# EAGLE design sunhub8_v1.0 (EAGLE 6.2)
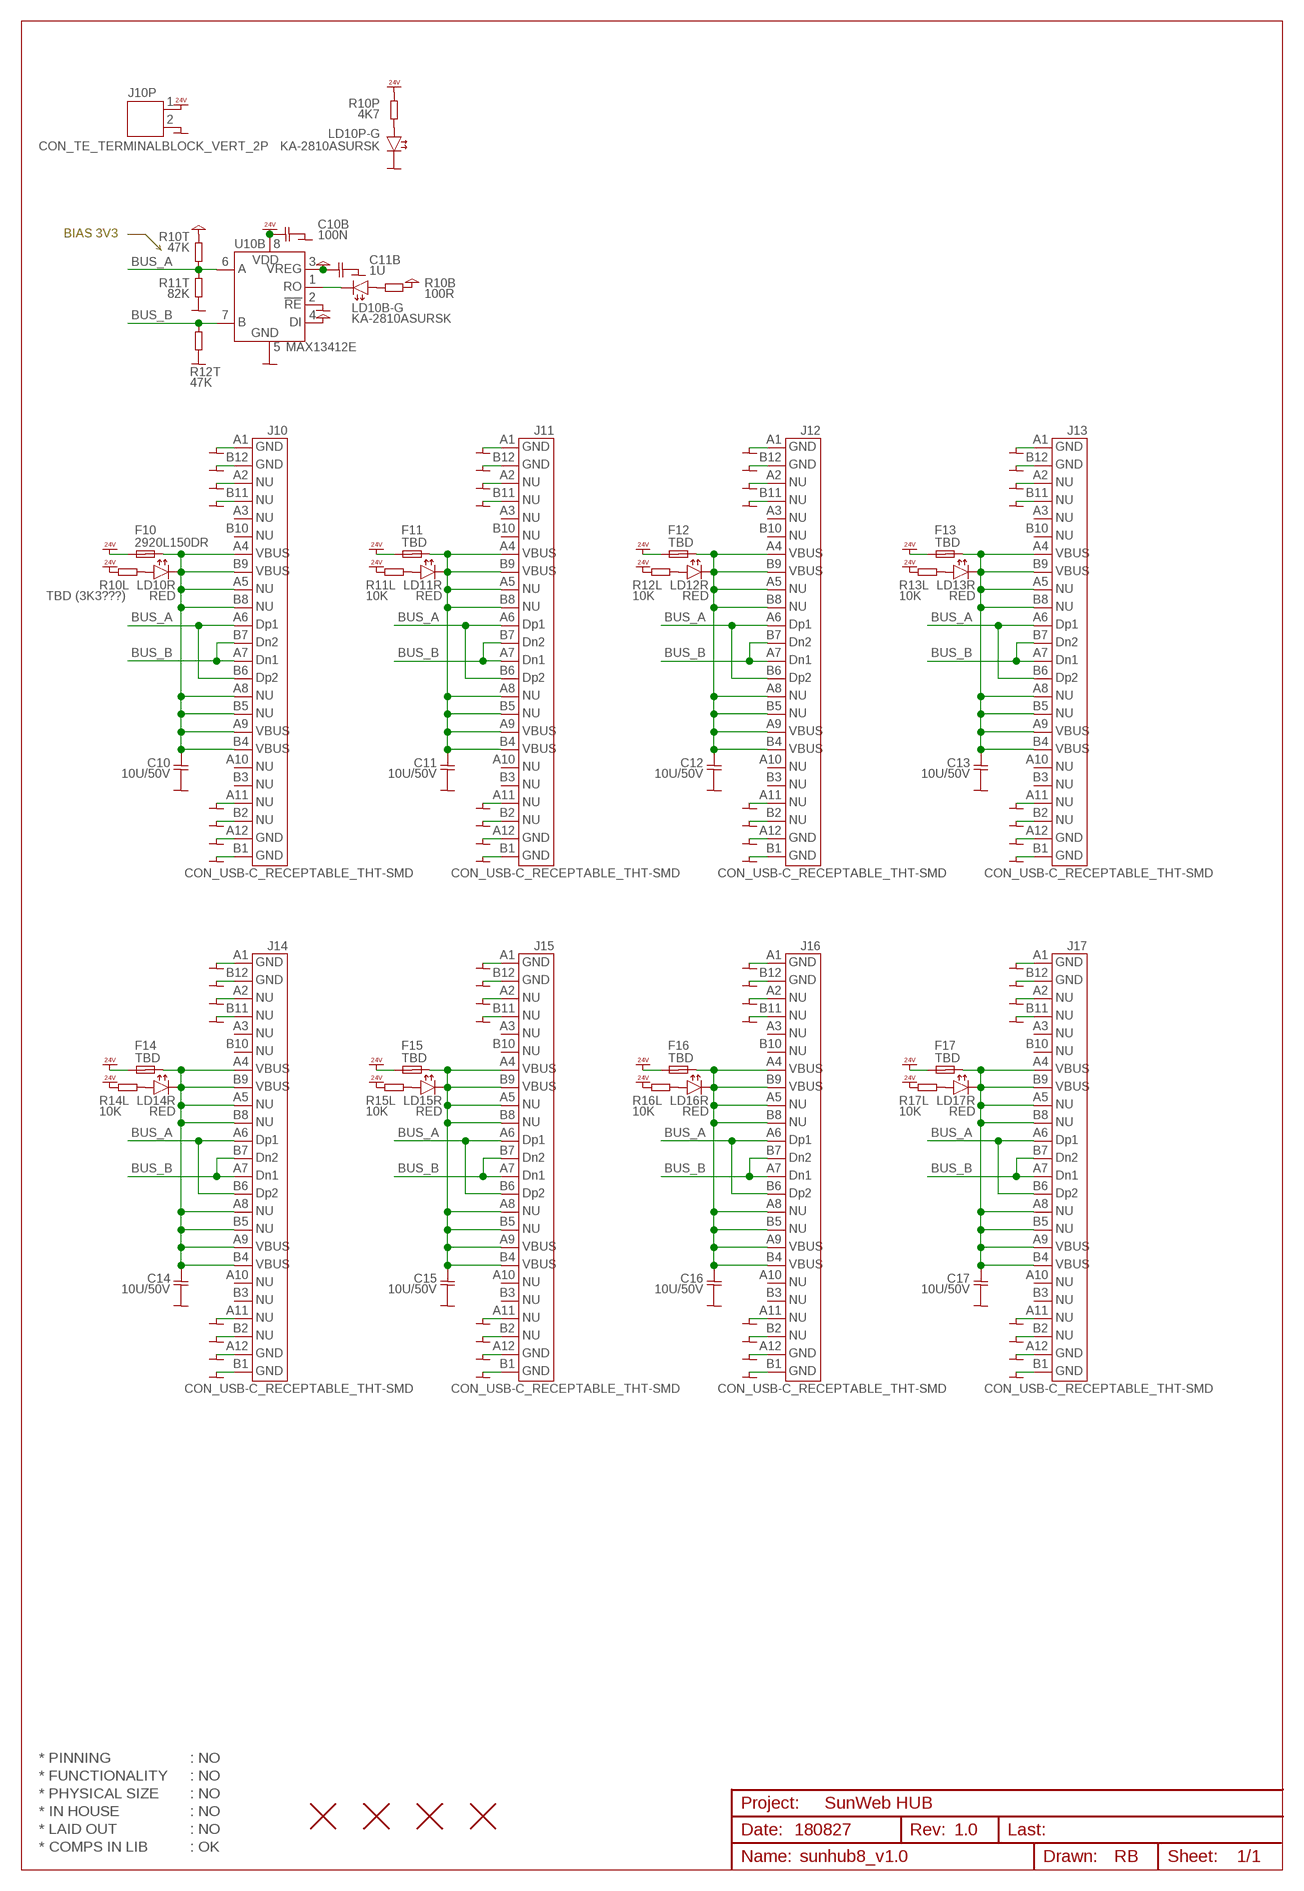
[diagram p0: schematic, sheet 1]

## Parts
C10  10U/50V  CAP1206  [CAP1206]
C10B  100N  CAP0603  [CAP0603]
C11  10U/50V  CAP1206  [CAP1206]
C11B  1U  CAP0603  [CAP0603]
C12  10U/50V  CAP1206  [CAP1206]
C13  10U/50V  CAP1206  [CAP1206]
C14  10U/50V  CAP1206  [CAP1206]
C15  10U/50V  CAP1206  [CAP1206]
C16  10U/50V  CAP1206  [CAP1206]
C17  10U/50V  CAP1206  [CAP1206]
F10  2920L150DR  POLYFUSE2920  [POLYFUSE2920]
F11  TBD  POLYFUSE2920  [POLYFUSE2920]
F12  TBD  POLYFUSE2920  [POLYFUSE2920]
F13  TBD  POLYFUSE2920  [POLYFUSE2920]
F14  TBD  POLYFUSE2920  [POLYFUSE2920]
F15  TBD  POLYFUSE2920  [POLYFUSE2920]
F16  TBD  POLYFUSE2920  [POLYFUSE2920]
F17  TBD  POLYFUSE2920  [POLYFUSE2920]
H1  HOLE_NPTH_3.2MM  [HOLE_NPTH_3.2MM]
H2  HOLE_NPTH_3.2MM  [HOLE_NPTH_3.2MM]
H3  HOLE_NPTH_3.2MM  [HOLE_NPTH_3.2MM]
H4  HOLE_NPTH_3.2MM  [HOLE_NPTH_3.2MM]
J10  CON_USB-C_RECEPTABLE_THT-SMD  [CON_USB-C_RECEPTABLE_THT-SMD]
J10P  CON_TE_TERMINALBLOCK_VERT_2P  [CON_TE_TERMINALBLOCK_VERT_2P]
J11  CON_USB-C_RECEPTABLE_THT-SMD  [CON_USB-C_RECEPTABLE_THT-SMD]
J12  CON_USB-C_RECEPTABLE_THT-SMD  [CON_USB-C_RECEPTABLE_THT-SMD]
J13  CON_USB-C_RECEPTABLE_THT-SMD  [CON_USB-C_RECEPTABLE_THT-SMD]
J14  CON_USB-C_RECEPTABLE_THT-SMD  [CON_USB-C_RECEPTABLE_THT-SMD]
J15  CON_USB-C_RECEPTABLE_THT-SMD  [CON_USB-C_RECEPTABLE_THT-SMD]
J16  CON_USB-C_RECEPTABLE_THT-SMD  [CON_USB-C_RECEPTABLE_THT-SMD]
J17  CON_USB-C_RECEPTABLE_THT-SMD  [CON_USB-C_RECEPTABLE_THT-SMD]
LD10B-G  KA-2810ASURSK  LED_SMD_ANGLE  [LED_SMD_ANGLE]
LD10P-G  KA-2810ASURSK  LED_SMD_ANGLE  [LED_SMD_ANGLE]
LD10R  RED  LED_SMD_ANGLE  [LED_SMD_ANGLE]
LD11R  RED  LED_SMD_ANGLE  [LED_SMD_ANGLE]
LD12R  RED  LED_SMD_ANGLE  [LED_SMD_ANGLE]
LD13R  RED  LED_SMD_ANGLE  [LED_SMD_ANGLE]
LD14R  RED  LED_SMD_ANGLE  [LED_SMD_ANGLE]
LD15R  RED  LED_SMD_ANGLE  [LED_SMD_ANGLE]
LD16R  RED  LED_SMD_ANGLE  [LED_SMD_ANGLE]
LD17R  RED  LED_SMD_ANGLE  [LED_SMD_ANGLE]
R10B  100R  RES0603  [RES0603]
R10L  TBD (3K3???)  RES0603  [RES0603]
R10P  4K7  RES0603  [RES0603]
R10T  47K  RES0603  [RES0603]
R11L  10K  RES0603  [RES0603]
R11T  82K  RES0603  [RES0603]
R12L  10K  RES0603  [RES0603]
R12T  47K  RES0603  [RES0603]
R13L  10K  RES0603  [RES0603]
R14L  10K  RES0603  [RES0603]
R15L  10K  RES0603  [RES0603]
R16L  10K  RES0603  [RES0603]
R17L  10K  RES0603  [RES0603]
U10B  MAX13412E  [SO8]

## Nets
BUS_A: J10.A6(A6.DP1) J10.B6(B6.DP2) J11.A6(A6.DP1) J11.B6(B6.DP2) J12.A6(A6.DP1) J12.B6(B6.DP2) J13.A6(A6.DP1) J13.B6(B6.DP2) J14.A6(A6.DP1) J14.B6(B6.DP2) J15.A6(A6.DP1) J15.B6(B6.DP2) J16.A6(A6.DP1) J16.B6(B6.DP2) J17.A6(A6.DP1) J17.B6(B6.DP2) R10T.2 R11T.1 U10B.6(6.A)
BUS_B: J10.A7(A7.DN1) J10.B7(B7.DN2) J11.A7(A7.DN1) J11.B7(B7.DN2) J12.A7(A7.DN1) J12.B7(B7.DN2) J13.A7(A7.DN1) J13.B7(B7.DN2) J14.A7(A7.DN1) J14.B7(B7.DN2) J15.A7(A7.DN1) J15.B7(B7.DN2) J16.A7(A7.DN1) J16.B7(B7.DN2) J17.A7(A7.DN1) J17.B7(B7.DN2) R12T.1 U10B.7(7.B)
GND: C10.2 C10B.2 C11.2 C11B.2 C12.2 C13.2 C14.2 C15.2 C16.2 C17.2 J10.A1(A1.GND) J10.A2(A2.NU) J10.A11(A11.NU) J10.A12(A12.GND) J10.B1(B1.GND) J10.B2(B2.NU) J10.B11(B11.NU) J10.B12(B12.GND) J10P.2 J11.A1(A1.GND) J11.A2(A2.NU) J11.A11(A11.NU) J11.A12(A12.GND) J11.B1(B1.GND) J11.B2(B2.NU) J11.B11(B11.NU) J11.B12(B12.GND) J12.A1(A1.GND) J12.A2(A2.NU) J12.A11(A11.NU) J12.A12(A12.GND) J12.B1(B1.GND) J12.B2(B2.NU) J12.B11(B11.NU) J12.B12(B12.GND) J13.A1(A1.GND) J13.A2(A2.NU) J13.A11(A11.NU) J13.A12(A12.GND) J13.B1(B1.GND) J13.B2(B2.NU) J13.B11(B11.NU) J13.B12(B12.GND) J14.A1(A1.GND) J14.A2(A2.NU) J14.A11(A11.NU) J14.A12(A12.GND) J14.B1(B1.GND) J14.B2(B2.NU) J14.B11(B11.NU) J14.B12(B12.GND) J15.A1(A1.GND) J15.A2(A2.NU) J15.A11(A11.NU) J15.A12(A12.GND) J15.B1(B1.GND) J15.B2(B2.NU) J15.B11(B11.NU) J15.B12(B12.GND) J16.A1(A1.GND) J16.A2(A2.NU) J16.A11(A11.NU) J16.A12(A12.GND) J16.B1(B1.GND) J16.B2(B2.NU) J16.B11(B11.NU) J16.B12(B12.GND) J17.A1(A1.GND) J17.A2(A2.NU) J17.A11(A11.NU) J17.A12(A12.GND) J17.B1(B1.GND) J17.B2(B2.NU) J17.B11(B11.NU) J17.B12(B12.GND) LD10P-G.C R11T.2 R12T.2 U10B.2(2.!RE) U10B.5(5.GND)
N$1: C10.1 F10.2 J10.A4(A4.VBUS) J10.A5(A5.NU) J10.A8(A8.NU) J10.A9(A9.VBUS) J10.B4(B4.VBUS) J10.B5(B5.NU) J10.B8(B8.NU) J10.B9(B9.VBUS) LD10R.C
N$2: C11.1 F11.2 J11.A4(A4.VBUS) J11.A5(A5.NU) J11.A8(A8.NU) J11.A9(A9.VBUS) J11.B4(B4.VBUS) J11.B5(B5.NU) J11.B8(B8.NU) J11.B9(B9.VBUS) LD11R.C
N$3: LD11R.A R11L.2
N$4: C12.1 F12.2 J12.A4(A4.VBUS) J12.A5(A5.NU) J12.A8(A8.NU) J12.A9(A9.VBUS) J12.B4(B4.VBUS) J12.B5(B5.NU) J12.B8(B8.NU) J12.B9(B9.VBUS) LD12R.C
N$5: C13.1 F13.2 J13.A4(A4.VBUS) J13.A5(A5.NU) J13.A8(A8.NU) J13.A9(A9.VBUS) J13.B4(B4.VBUS) J13.B5(B5.NU) J13.B8(B8.NU) J13.B9(B9.VBUS) LD13R.C
N$6: C14.1 F14.2 J14.A4(A4.VBUS) J14.A5(A5.NU) J14.A8(A8.NU) J14.A9(A9.VBUS) J14.B4(B4.VBUS) J14.B5(B5.NU) J14.B8(B8.NU) J14.B9(B9.VBUS) LD14R.C
N$7: C15.1 F15.2 J15.A4(A4.VBUS) J15.A5(A5.NU) J15.A8(A8.NU) J15.A9(A9.VBUS) J15.B4(B4.VBUS) J15.B5(B5.NU) J15.B8(B8.NU) J15.B9(B9.VBUS) LD15R.C
N$8: C16.1 F16.2 J16.A4(A4.VBUS) J16.A5(A5.NU) J16.A8(A8.NU) J16.A9(A9.VBUS) J16.B4(B4.VBUS) J16.B5(B5.NU) J16.B8(B8.NU) J16.B9(B9.VBUS) LD16R.C
N$9: C17.1 F17.2 J17.A4(A4.VBUS) J17.A5(A5.NU) J17.A8(A8.NU) J17.A9(A9.VBUS) J17.B4(B4.VBUS) J17.B5(B5.NU) J17.B8(B8.NU) J17.B9(B9.VBUS) LD17R.C
N$10: LD10R.A R10L.2
N$11: LD12R.A R12L.2
N$12: LD13R.A R13L.2
N$13: LD14R.A R14L.2
N$14: LD15R.A R15L.2
N$15: LD16R.A R16L.2
N$16: LD17R.A R17L.2
N$17: LD10B-G.A R10B.1
N$18: LD10B-G.C U10B.1(1.RO)
N$83: LD10P-G.A R10P.2
VCC: C11B.1 R10B.2 R10T.1 U10B.3(3.DE) U10B.4(4.DI)
VDD_24V: C10B.1 F10.1 F11.1 F12.1 F13.1 F14.1 F15.1 F16.1 F17.1 J10P.1 R10L.1 R10P.1 R11L.1 R12L.1 R13L.1 R14L.1 R15L.1 R16L.1 R17L.1 U10B.8(8.VDD) ; supply symbol labelled VCC_24V
Unconnected: J10.A3(A3.NU) J10.A10(A10.NU) J10.B3(B3.NU) J10.B10(B10.NU) J11.A3(A3.NU) J11.A10(A10.NU) J11.B3(B3.NU) J11.B10(B10.NU) J12.A3(A3.NU) J12.A10(A10.NU) J12.B3(B3.NU) J12.B10(B10.NU) J13.A3(A3.NU) J13.A10(A10.NU) J13.B3(B3.NU) J13.B10(B10.NU) J14.A3(A3.NU) J14.A10(A10.NU) J14.B3(B3.NU) J14.B10(B10.NU) J15.A3(A3.NU) J15.A10(A10.NU) J15.B3(B3.NU) J15.B10(B10.NU) J16.A3(A3.NU) J16.A10(A10.NU) J16.B3(B3.NU) J16.B10(B10.NU) J17.A3(A3.NU) J17.A10(A10.NU) J17.B3(B3.NU) J17.B10(B10.NU)

## Notes on the sheet
- BIAS 3V3
- * PINNING | : NO
- * FUNCTIONALITY | : NO
- * PHYSICAL SIZE | : NO
- SunWeb HUB
- * IN HOUSE | : NO
- * LAID OUT | : NO | 180827 | 1.0
- * COMPS IN LIB | : OK

## Library data of the parts
C10-C17 = 00-own_parts:CAP1206: Capacitor, ceramic, 1206
C10B C11B = 00-own_parts:CAP0603: Capacitor, ceramic, 0603
F10-F17 = 00-own_parts:POLYFUSE2920
H1-H4 = 00-own_parts:HOLE_NPTH_3.2MM: Hole, NPTH, 3.2mm
J10-J17 = 00-own_parts:CON_USB-C_RECEPTABLE_THT-SMD: Connector, DB25, male, straight, wirewarp, press nuts, DK#: 2625FA-ND
J10P = 00-own_parts:CON_TE_TERMINALBLOCK_VERT_2P: Connector,TE Conn., terminal block, vertical, 3.5mm, 2p, RS#123-2041
LD10B-G LD10P-G = 00-led_angle:LED_SMD_ANGLE: LED, SMD, right angle, F#214-6470
LD10R LD11R LD12R LD13R LD14R LD15R LD16R LD17R = 00-own_parts:LED_SMD_ANGLE: LED, SMD, right angle, F#214-6470
R10B R10L R10P R10T R11L R11T R12L R12T R13L R14L R15L R16L R17L = 00-own_parts:RES
U10B = 00-own_parts:MAX13412E: Transceiver, RS485, 6..28V, internal 5V LDO, 500kbps, SO8 exposed pad, RS#786-0087

## Board
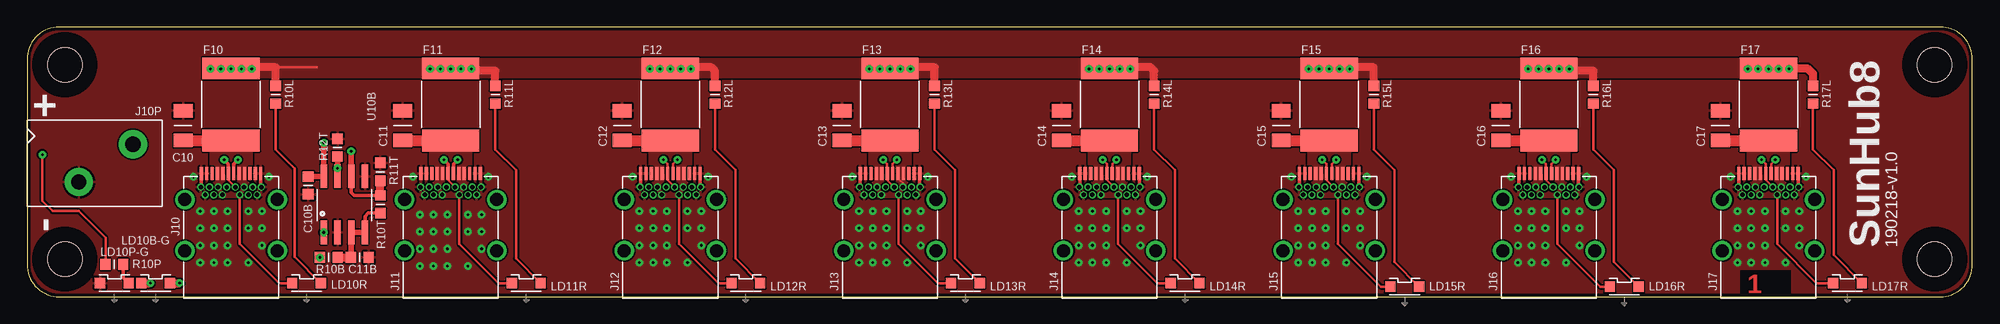
[diagram p1: board, top side]
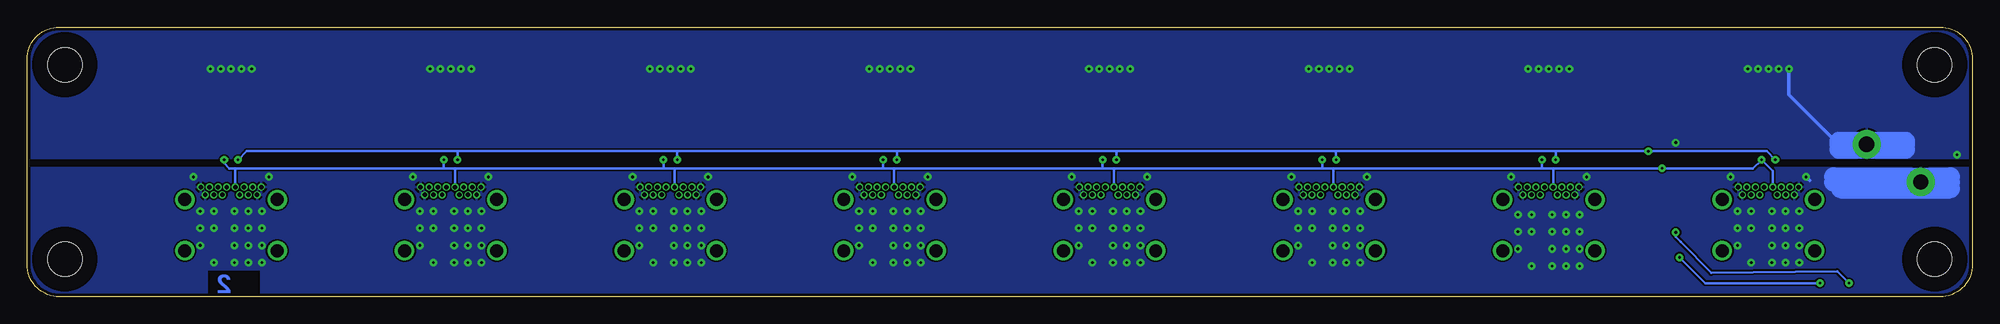
[diagram p2: board, bottom side, seen from below]

Size 180 x 25 mm. Coordinates in mm from the lower left corner, seen from the top.
Outline: 3,0 177,0 arc90 180,3 180,22 arc90 177,25 3,25 arc90 0,22 0,3 arc90 3,0
Copper layers (1*16): Top 0.018mm / dielectric 1.55mm / Bottom 0.018mm
Design rules: minimum track width 0.15mm, minimum drill 0.25mm, track to track 0.15mm, track to pad 0.15mm, pad to pad 0.15mm, via to via 0.15mm, smd to smd 0mil, copper to edge 0.3mm, drill to drill 0.3mm, minimum pad ring 0.125mm, minimum via ring 0.2mm, stop-mask expansion 0.1mm, vias tented up to drill 0.4mm, thermal gap 0.2mm

### Footprints (pad centres in the part's own frame; a part is rotated, then mirrored left to right if it is on the bottom)
CAP1206 = smd 1.25 x 1.75: 1 -1.375,0; 2 1.375,0
CAP0603 = smd 0.95 x 1: 1 -0.821,0.002; 2 0.822,0
POLYFUSE2920 = smd 2 x 5.3: 1 -3.4,0; 2 3.3,0
HOLE_NPTH_3.2MM = hole 3.2: 0,0
CON_USB-C_RECEPTABLE_THT-SMD = smd 0.3 x 1.2: A1 -2.75,1.25; A2 -2.25,1.25; A3 -1.75,1.25; A4 -1.25,1.25; A5 -0.75,1.25; A6 -0.25,1.25; A7 0.25,1.25; A8 0.75,1.25; A9 1.25,1.25; A10 1.75,1.25; A11 2.25,1.25; A12 2.75,1.25 | drill 0.4 pad 0.65: B1 2.8,0; B2 2.4,-0.7; B3 1.6,-0.7; B4 1.2,0; B5 0.8,-0.7; B6 0.4,0; B7 -0.4,0; B8 -0.8,-0.7; B9 -1.2,0; B10 -1.6,-0.7; B11 -2.4,-0.7; B12 -2.8,0; BG1 2,0; BG2 -2,0 | drill 1.2 pad 1.8: C1 -4.27,-5.88; C2 4.27,-5.88; C3 -4.27,-1.15; C4 4.27,-1.15
CON_TE_TERMINALBLOCK_VERT_2P = drill 1.4 pad 2.6: 1 -1.75,3.3; 2 1.75,-1.7
LED_SMD_ANGLE = smd 0.95 x 1: A -1.327,0; C 1.327,0
RES0603 = smd 0.95 x 1: 1 -0.821,0.002; 2 0.822,0
SO8 = smd 0.6 x 2.2: 1 -1.905,-2.6; 2 -0.635,-2.6; 3 0.635,-2.6; 4 1.905,-2.6; 5 1.905,2.6; 6 0.635,2.6; 7 -0.635,2.6; 8 -1.905,2.6

### Placement (x,y rotation side)
C10  14.44,15.88 90 top
C10B  26.02,10.32 270 top
C11  34.76,15.88 90 top
C11B  30.79,3.65 0 top
C12  55.08,15.88 90 top
C13  75.39,15.88 90 top
C14  95.72,15.88 90 top
C15  116.03,15.88 90 top
C16  136.35,15.88 90 top
C17  156.68,15.88 90 top
F10  18.88,17.78 270 top
F11  39.2,17.78 270 top
F12  59.52,17.78 270 top
F13  79.84,17.78 270 top
F14  100.16,17.78 270 top
F15  120.48,17.78 270 top
F16  140.8,17.78 270 top
F17  161.12,17.78 270 top
H1  3.5,3.5 0 top
H2  3.5,21.5 0 top
H3  176.5,21.5 0 top
H4  176.5,3.5 0 top
J10  18.88,10.16 0 top
J10P  6.5,12.38 270 top
J11  39.2,10.16 0 top
J12  59.52,10.16 0 top
J13  79.84,10.16 0 top
J14  100.16,10.16 0 top
J15  120.48,10.16 0 top
J16  140.8,10.16 0 top
J17  161.12,10.16 0 top
LD10B-G  11.89,1.27 180 top
LD10P-G  8.08,1.27 180 top
LD10R  25.86,1.27 180 top
LD11R  46.19,1.27 180 top
LD12R  66.5,1.27 180 top
LD13R  86.83,1.27 180 top
LD14R  107.14,1.27 180 top
LD15R  127.47,0.95 180 top
LD16R  147.78,0.95 180 top
LD17R  168.42,1.27 180 top
R10B  27.93,3.65 0 top
R10L  23.01,18.73 270 top
R10P  8.08,3.02 0 top
R10T  32.69,8.57 90 top
R11L  43.33,18.73 270 top
R11T  32.69,11.59 90 top
R12L  63.65,18.73 270 top
R12T  28.72,13.81 90 top
R13L  83.97,18.73 270 top
R14L  104.29,18.73 270 top
R15L  124.61,18.73 270 top
R16L  144.93,18.73 270 top
R17L  165.25,18.73 270 top
U10B  29.36,8.57 0 top

### Tracks (layer width: path | path; a pad name or v marks a point on that pad's centre or on a via)
BUS_A  (via drill 0.25 pad 0.7)
  Top 0.152: J12.B6 59.27,10.81 J12.A6 | J13.A6 79.59,10.81 J13.B6 | J14.A6 99.91,10.81 J14.B6 | J15.A6 120.23,10.81 J15.B6 | J16.A6 140.55,10.81 J16.B6 | J17.A6 160.87,10.81 J17.B6 | J10.A6 18.63,10.81 J10.B6 | J11.B6 38.95,10.81 J11.A6
  Top 0.254: J12.A6 59.27,12.31 v58.89,12.7 | J13.A6 79.59,12.31 v79.2,12.7 | J14.A6 99.91,12.31 v99.53,12.7 | J15.A6 120.23,12.31 v119.84,12.7 | J16.A6 140.55,12.31 v140.16,12.7 | J17.A6 160.87,12.31 v160.49,12.7
  Top 0.305: v18.25,12.7 18.63,12.31 J10.A6 | v38.56,12.7 38.95,12.31 J11.A6 | U10B.6 29.99,9.68 30.28,9.39 R10T.2
  Top 0.508: U10B.6 v29.99,13.49
  Top 0.762: R10T.2 R11T.1
  Bottom 0.254: v160.49,12.7 159.69,13.49 140.16,13.49 | 140.16,13.49 119.84,13.49 | 119.84,13.49 99.53,13.49 | 99.53,13.49 79.2,13.49 | 79.2,13.49 58.89,13.49 | 58.89,13.49 38.56,13.49 | 38.56,13.49 v29.99,13.49 19.04,13.49 v18.25,12.7 | v38.56,12.7 38.56,13.49 | v58.89,12.7 58.89,13.49 | v79.2,12.7 79.2,13.49 | v99.53,12.7 99.53,13.49 | v140.16,12.7 140.16,13.49 | v119.84,12.7 119.84,13.49
BUS_B  (via drill 0.25 pad 0.7)
  Top 0.254: J12.A7 59.77,12.31 v60.16,12.7 | J13.A7 80.09,12.31 v80.47,12.7 | J14.A7 100.41,12.31 v100.8,12.7 | J15.A7 120.73,12.31 v121.11,12.7 | J16.A7 141.05,12.31 v141.44,12.7 | J17.A7 161.37,12.31 v161.75,12.7
  Top 0.305: v19.52,12.7 19.13,12.31 J10.A7 | v39.84,12.7 39.45,12.31 J11.A7 | R12T.1
  Top 0.508: U10B.7 v28.72,11.91 R12T.1
  Bottom 0.254: J10.B7 18.48,11.66 v19.52,12.7 20.31,11.91 v28.72,11.91 38.88,11.91 | 38.88,11.91 39.84,11.91 | 39.84,11.91 59.2,11.91 | 59.2,11.91 60.16,11.91 | 60.16,11.91 79.52,11.91 | 79.52,11.91 80.47,11.91 | 80.47,11.91 99.84,11.91 | 99.84,11.91 100.8,11.91 | v100.8,12.7 100.8,11.91 | v80.47,12.7 80.47,11.91 | v60.16,12.7 60.16,11.91 | v39.84,12.7 39.84,11.91 | 100.8,11.91 120.16,11.91 | 120.16,11.91 121.11,11.91 | 121.11,11.91 140.48,11.91 | 140.48,11.91 141.44,11.91 | 141.44,11.91 160.8,11.91 | 160.8,11.91 161.28,11.91 161.75,12.38 v161.75,12.7 | v141.44,12.7 141.44,11.91 | v121.11,12.7 121.11,11.91 | J17.B7 160.72,11.82 160.8,11.91 | J16.B7 140.4,11.82 140.48,11.91 | J15.B7 120.08,11.82 120.16,11.91 | J14.B7 99.76,11.82 99.84,11.91 | J13.B7 79.44,11.82 79.52,11.91 | J12.B7 59.12,11.82 59.2,11.91 | J11.B7 38.8,11.82 38.88,11.91
GND  (via drill 0.25 pad 0.7)
  Top 0.305: J10.A1 16.13,10.27 16.02,10.16 | J10.A12 21.63,10.27 21.74,10.16 | J12.A1 56.77,10.27 | J12.A12 62.27,10.27 | J13.A1 77.09,10.27 | J13.A12 82.59,10.27 | J14.A1 97.41,10.27 | J14.A12 102.91,10.27 | J15.A1 117.73,10.27 | J15.A12 123.23,10.27 | J16.A1 138.05,10.27 | J16.A12 143.55,10.27 | J17.A1 158.37,10.27 | J17.A12 163.87,10.27
  Bottom 0.305: v15.39,11.11 15.07,10.79
  Bottom 1.778: 12.85,10.64 2.05,10.64 | 12.21,10 2.05,10 | 12.85,11.11 2.05,11.11
  other vias: 22.37,11.11 35.71,11.11 42.69,11.11 56.03,11.11 63.01,11.11 76.35,11.11 83.33,11.11 96.67,11.11 103.65,11.11 116.99,11.11 123.97,11.11 137.31,11.11 144.29,11.11 157.63,11.11 164.61,11.11 16.02,7.94 21.74,7.94 20.47,7.94 17.29,7.94 16.02,6.35 17.29,6.35 20.47,6.35 16.02,4.76 17.29,4.76 16.02,3.17 17.29,3.17 18.56,7.94 18.56,6.35 18.56,4.76 18.56,3.17 20.47,3.17 21.74,4.76 21.74,6.35 36.34,7.62 42.06,7.62 40.79,7.62 37.61,7.62 36.34,6.03 37.61,6.03 40.79,6.03 36.34,4.45 37.61,4.45 36.34,2.86 37.61,2.86 38.88,7.62 38.88,6.03 38.88,4.45 38.88,2.86 40.79,2.86 42.06,4.45 42.06,6.03 56.66,7.94 62.38,7.94 61.11,7.94 57.93,7.94 56.66,6.35 57.93,6.35 61.11,6.35 56.66,4.76 57.93,4.76 56.66,3.17 57.93,3.17 59.2,7.94 59.2,6.35 59.2,4.76 59.2,3.17 61.11,3.17 62.38,4.76 62.38,6.35 76.98,7.94 82.7,7.94 81.43,7.94 78.25,7.94 76.98,6.35 78.25,6.35 81.43,6.35 76.98,4.76 78.25,4.76 76.98,3.17 78.25,3.17 79.52,7.94 79.52,6.35 79.52,4.76 79.52,3.17 81.43,3.17 82.7,4.76 82.7,6.35 97.3,7.94 103.02,7.94 101.75,7.94 98.57,7.94 97.3,6.35 98.57,6.35 101.75,6.35 97.3,4.76 98.57,4.76 97.3,3.17 98.57,3.17 99.84,7.94 99.84,6.35 99.84,4.76 99.84,3.17 101.75,3.17 103.02,4.76 103.02,6.35 117.62,7.94 123.34,7.94 122.07,7.94 118.89,7.94 117.62,6.35 118.89,6.35 122.07,6.35 117.62,4.76 118.89,4.76 117.62,3.17 118.89,3.17 120.16,7.94 120.16,6.35 120.16,4.76 120.16,3.17 122.07,3.17 123.34,4.76 123.34,6.35 137.94,7.94 143.66,7.94 142.39,7.94 139.21,7.94 137.94,6.35 139.21,6.35 142.39,6.35 137.94,4.76 139.21,4.76 137.94,3.17 139.21,3.17 140.48,7.94 140.48,6.35 140.48,4.76 140.48,3.17 142.39,3.17 143.66,4.76 143.66,6.35 158.26,7.94 163.98,7.94 162.71,7.94 159.53,7.94 158.26,6.35 159.53,6.35 162.71,6.35 158.26,4.76 159.53,4.76 158.26,3.17 159.53,3.17 160.8,7.94 160.8,6.35 160.8,4.76 160.8,3.17 162.71,3.17 163.98,4.76 163.98,6.35
  pour Top (rank 3): 0.26,0 0.04,24.96 180,24.96 180,0 163.34,0 163.34,2.54 158.39,2.54 158.39,0
  pour Bottom: -0.06,0 0.04,11.95 180.02,11.95 179.98,0 163.34,0 163.34,2.54 158.39,2.54 158.39,0
N$1
  Top 0.254: J10.B5 19.68,4.92 23.33,1.27 LD10R.C
  Top 1.016: C10.1 18.86,14.5 F10.2
  pour Top (no thermals): 16.97,9.21 16.97,15.24 20.78,15.24 20.78,9.21
N$2
  Top 0.254: J11.B5 40,4.92 43.65,1.27 LD11R.C
  Top 1.016: C11.1 39.18,14.5 F11.2
  pour Top (no thermals): 37.3,9.21 37.3,15.24 41.1,15.24 41.1,9.21
N$3
  Top 0.254: R11L.2 43.33,13.65 45.23,11.75 45.23,3.55 LD11R.A
N$4
  Top 0.254: J12.B5 60.32,4.92 63.97,1.27 LD12R.C
  Top 1.016: C12.1 59.5,14.5 F12.2
  pour Top (no thermals): 57.62,9.21 57.62,15.24 61.42,15.24 61.42,9.21
N$5
  Top 0.152: J13.B4 81.04,10.55 80.79,10.79
  Top 0.254: J13.B5 80.64,4.92 84.28,1.27 LD13R.C
  Top 1.016: C13.1 79.82,14.5 F13.2
  pour Top (no thermals): 77.94,9.21 77.94,15.24 81.75,15.24 81.75,9.21
N$6
  Top 0.254: J14.B5 100.96,4.92 104.61,1.27 LD14R.C
  Top 1.016: C14.1 100.14,14.5 F14.2
  pour Top (no thermals): 98.25,9.21 98.25,15.24 102.06,15.24 102.06,9.21
N$7
  Top 0.254: J15.B5 121.28,4.92 125.24,0.95 LD15R.C
  Top 1.016: C15.1 120.46,14.5 F15.2
  pour Top (no thermals): 118.58,9.21 118.58,15.24 122.38,15.24 122.38,9.21
N$8
  Top 0.254: J16.B5 141.6,4.92 145.56,0.95 LD16R.C
  Top 1.016: C16.1 140.78,14.5 F16.2
  pour Top (no thermals): 138.9,9.21 138.9,15.24 142.7,15.24 142.7,9.21
N$9
  Top 0.254: J17.B5 161.92,4.92 165.56,1.27 LD17R.C
  Top 1.016: C17.1 161.1,14.5 F17.2
  pour Top (no thermals): 159.22,9.21 159.22,15.24 163.03,15.24 163.03,9.21
N$10
  Top 0.254: R10L.2 23.01,13.65 24.75,11.91 24.75,3.71 LD10R.A
N$11
  Top 0.254: R12L.2 63.65,13.65 65.55,11.75 65.55,3.55 LD12R.A
N$12
  Top 0.254: R13L.2 83.97,13.65 85.87,11.75 85.87,3.55 LD13R.A
N$13
  Top 0.254: R14L.2 104.29,13.65 106.19,11.75 106.19,3.55 LD14R.A
N$14
  Top 0.254: R15L.2 124.61,13.65 126.51,11.75 126.51,3.23 LD15R.A
N$15
  Top 0.254: R16L.2 144.93,13.65 146.83,11.75 146.83,3.23 LD16R.A
N$16
  Top 0.254: R17L.2 165.25,13.65 167.15,11.75 167.15,3.87 LD17R.A
N$17  (via drill 0.25 pad 0.7)
  Top 0.762: LD10B-G.A v14.12,1.27
  Bottom 0.254: v14.12,1.27 24.72,1.27 R10B.1
  other vias: 27.11,3.65
N$18  (via drill 0.25 pad 0.7)
  Top 0.254: U10B.1 27.45,5.4
  Top 0.762: LD10B-G.C v11.42,1.27
  Bottom 0.254: v11.42,1.27 12.53,2.38 24.18,2.22 26.98,5.08 27.45,5.56 U10B.1
  other vias: 27.45,5.97
N$83
  Top 0.305: R10P.2 8.91,1.77 LD10P-G.A
VCC
  Top 0.305: U10B.4 31.26,7.46 31.55,7.75 R10T.1
  Top 0.508: C11B.1 29.99,3.68 U10B.3 U10B.4
  Top 0.762: R10B.2 C11B.1
VDD_24V  (via drill 0.25 pad 0.7)
  Top 0.254: 26.82,21.27 18.97,21.27 | v159.22,21.11 159.37,20.95 163.03,20.95 | v1.42,13.18 1.42,8.89 2.37,7.94 4.78,7.94 7.26,5.45 R10P.1
  Top 0.508: v27.45,14.29 U10B.8 26.06,11.17 C10B.1
  Top 0.762: R10L.1 23.01,21.27 18.97,21.27 F10.1 | R11L.1 43.33,20.95 39.42,20.95 F11.1 | R12L.1 63.65,20.95 63.33,21.27 59.61,21.27 F12.1 | R13L.1 83.97,21.27 79.93,21.27 F13.1 | R14L.1 104.29,20.95 103.97,21.27 100.25,21.27 F14.1 | R15L.1 124.61,21.27 120.39,21.27 | 120.16,21.27 120.39,21.27 | 120.39,21.27 F15.1 | R16L.1 144.93,20.95 141.03,20.95 F16.1 | F17.1 164.7,21.18 165.25,20.64 R17L.1
  Bottom 0.305: v16.97,21.11 16.97,18.73 12.37,14.13 | 6.18,14.13 6.02,14.29
  Bottom 1.727: 12.37,14.13 6.18,14.13 | 12.37,14.45 6.18,14.45 | 12.37,13.65 6.18,13.65
  other vias: 17.93,21.11 18.88,21.11 19.83,21.11 20.78,21.11 38.25,21.11 39.2,21.11 37.3,21.11 40.15,21.11 41.1,21.11 58.57,21.11 59.52,21.11 57.62,21.11 60.47,21.11 61.42,21.11 78.89,21.11 79.84,21.11 77.94,21.11 80.79,21.11 81.75,21.11 99.21,21.11 100.16,21.11 98.25,21.11 101.11,21.11 102.06,21.11 119.53,21.11 120.48,21.11 118.58,21.11 121.43,21.11 122.38,21.11 139.85,21.11 140.8,21.11 138.9,21.11 141.75,21.11 142.7,21.11 160.17,21.11 161.12,21.11 162.07,21.11 163.03,21.11
  pour Top (no thermals): 16.34,20.32 16.34,22.07 163.66,22.07 163.66,20.32
  pour Bottom: -0.04,12.88 0.04,24.72 180.02,24.72 180.04,12.88

### Text on the board
Top: 1
Bottom: 2
tPlace: + | - | SunHub8 | 190218-v1.0